# Altium schematic sheet KeyBrdReader.SchDoc
size A; Organization: Altium Limited; Address1: L3, 12a Rodborough Rd; Address2: Frenchs Forest; Address3: NSW; Address4: Australia 2086; DocumentNumber: 1; SheetNumber: 1; SheetTotal: 1
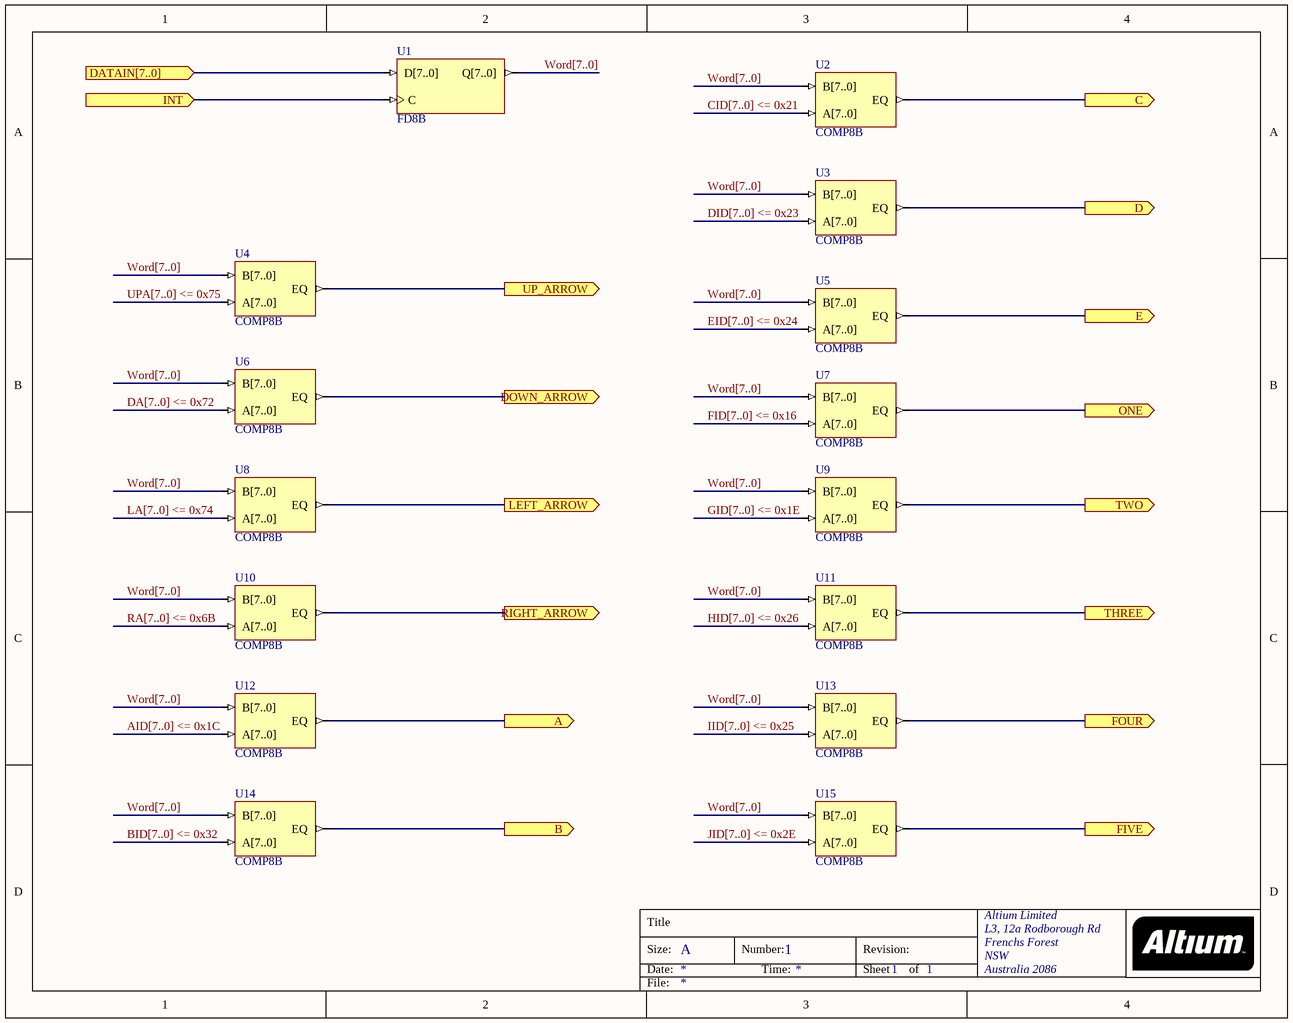
[diagram p0: KeyBrdReader.SchDoc]

## Parts
U1  FD8B
U2  COMP8B
U3  COMP8B
U4  COMP8B
U5  COMP8B
U6  COMP8B
U7  COMP8B
U8  COMP8B
U9  COMP8B
U10  COMP8B
U11  COMP8B
U12  COMP8B
U13  COMP8B
U14  COMP8B
U15  COMP8B

## Ports
A (out), B (out), C (out), D (out), DATAIN[7..0] (in), DOWN_ARROW (out), E (out), FIVE (out), FOUR (out), INT (in), LEFT_ARROW (out), ONE (out), RIGHT_ARROW (out), THREE (out), TWO (out), UP_ARROW (out)

## Nets
A: U12.EQ ; port A
AID[7..0] <= 0x1C: U12.A[7..0]
B: U14.EQ ; port B
BID[7..0] <= 0x32: U14.A[7..0]
C: U2.EQ ; port C
CID[7..0] <= 0x21: U2.A[7..0]
D: U3.EQ ; port D
DA[7..0] <= 0x72: U6.A[7..0]
DATAIN[7..0]: U1.D[7..0] ; port DATAIN[7..0]
DID[7..0] <= 0x23: U3.A[7..0]
DOWN_ARROW: U6.EQ ; port DOWN_ARROW
E: U5.EQ ; port E
EID[7..0] <= 0x24: U5.A[7..0]
FID[7..0] <= 0x16: U7.A[7..0]
FIVE: U15.EQ ; port FIVE
FOUR: U13.EQ ; port FOUR
GID[7..0] <= 0x1E: U9.A[7..0]
HID[7..0] <= 0x26: U11.A[7..0]
IID[7..0] <= 0x25: U13.A[7..0]
INT: U1.C ; port INT
JID[7..0] <= 0x2E: U15.A[7..0]
LA[7..0] <= 0x74: U8.A[7..0]
LEFT_ARROW: U8.EQ ; port LEFT_ARROW
ONE: U7.EQ ; port ONE
RA[7..0] <= 0x6B: U10.A[7..0]
RIGHT_ARROW: U10.EQ ; port RIGHT_ARROW
THREE: U11.EQ ; port THREE
TWO: U9.EQ ; port TWO
UP_ARROW: U4.EQ ; port UP_ARROW
UPA[7..0] <= 0x75: U4.A[7..0]
Word[7..0]: U1.Q[7..0] U2.B[7..0] U3.B[7..0] U4.B[7..0] U5.B[7..0] U6.B[7..0] U7.B[7..0] U8.B[7..0] U9.B[7..0] U10.B[7..0] U11.B[7..0] U12.B[7..0] U13.B[7..0] U14.B[7..0] U15.B[7..0]

## Buses and harness runs
bus AID[7..0] <= 0x1C
bus BID[7..0] <= 0x32
bus CID[7..0] <= 0x21
bus DA[7..0] <= 0x72
bus DID[7..0] <= 0x23
bus EID[7..0] <= 0x24
bus FID[7..0] <= 0x16
bus GID[7..0] <= 0x1E
bus HID[7..0] <= 0x26
bus IID[7..0] <= 0x25
bus JID[7..0] <= 0x2E
bus LA[7..0] <= 0x74
bus RA[7..0] <= 0x6B
bus UPA[7..0] <= 0x75
bus Word[7..0]

## Notes on the sheet
- Title
- Size:
- Date:
- A
- Number:
- Time:
- Revision:
- Sheet
- of
- File:

## Library data of the parts
U1 = FD8B: 8-Bit D-Type Flip-Flop, Bus Version; Xilinx Equivalent: FD8; ArchiveName: GENERIC; VHDLIB_SIM: GENERIC_LIB; Published: 28-Jan-2004; Publisher: Altium Limited; Core Revision: 1.00.00
U2-U15 = COMP8B: 8-Bit Identity Comparator, Bus Version; Xilinx Equivalent: COMP8; ArchiveName: GENERIC; VHDLIB_SIM: GENERIC_LIB; Published: 28-Jan-2004; Publisher: Altium Limited; Core Revision: 1.00.00